# EAGLE design Steering Controller (EAGLE 8.4.1)
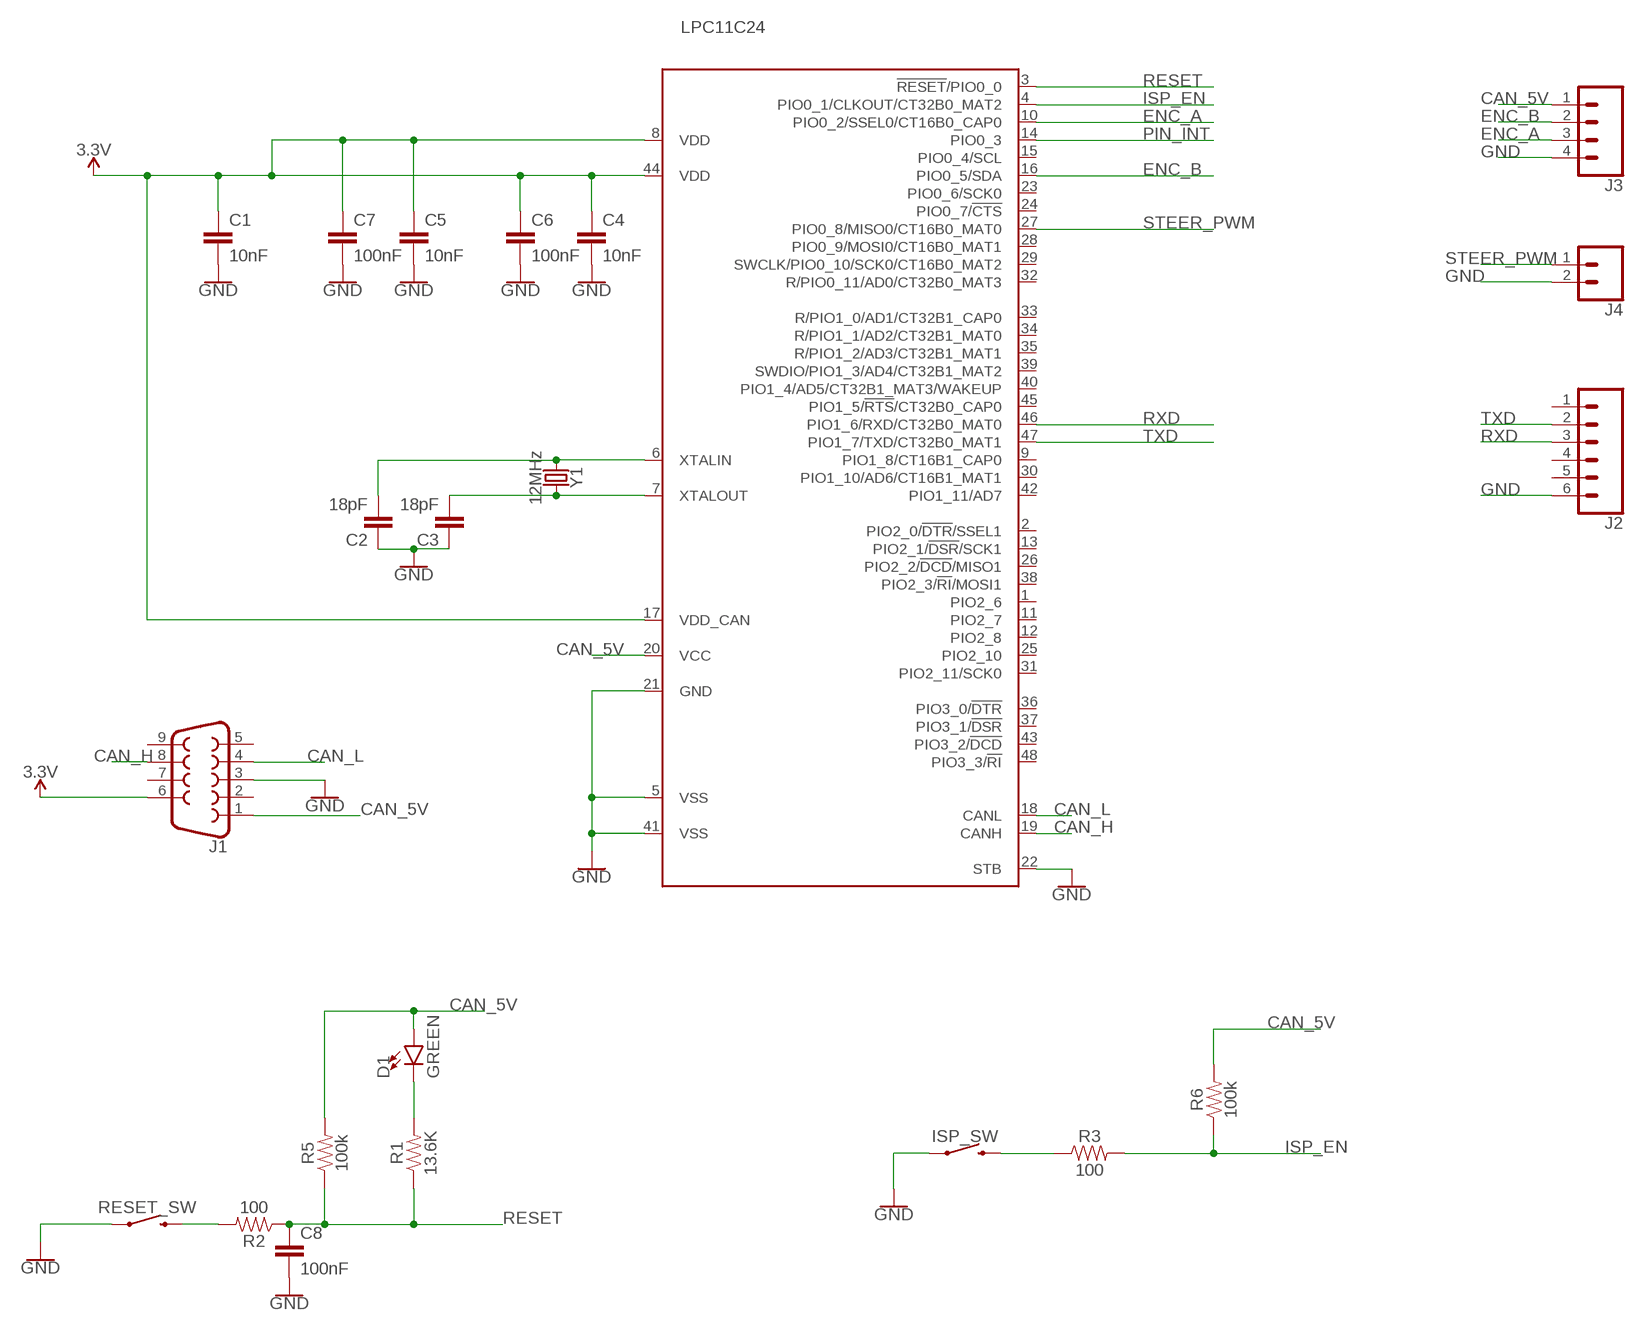
[diagram p0: schematic, sheet 1]

## Parts
C1  10nF  22PF-PTH-2.54MM-200V-5%  [CAP-PTH-2.54]
C2  18pF  22PF-PTH-2.54MM-200V-5%  [CAP-PTH-2.54]
C3  18pF  22PF-PTH-2.54MM-200V-5%  [CAP-PTH-2.54]
C4  10nF  22PF-PTH-2.54MM-200V-5%  [CAP-PTH-2.54]
C5  10nF  22PF-PTH-2.54MM-200V-5%  [CAP-PTH-2.54]
C6  100nF  22PF-PTH-2.54MM-200V-5%  [CAP-PTH-2.54]
C7  100nF  22PF-PTH-2.54MM-200V-5%  [CAP-PTH-2.54]
C8  100nF  22PF-PTH-2.54MM-200V-5%  [CAP-PTH-2.54]
D1  GREEN  LED-GREEN1206  [LED-1206]
ISP_SW  MOMENTARY-SWITCH-SPST-PTH-6.0MM  [TACTILE_SWITCH_PTH_6.0MM]
J1  DB9FEMALE  [DB9]
J2  CONN_06SILK_FEMALE_PTH  [1X06]
J3  CONN_04  [1X04]
J4  CONN_02  [1X02]
LPC11C24  LPC11C22/24-LQFP48  [LQFP48]
R1  13.6K  100KOHM-HORIZ-1/4W-1%  [AXIAL-0.3]
R2  100  100KOHM-HORIZ-1/4W-1%  [AXIAL-0.3]
R3  100  100OHM-HORIZ-1/4W-1%  [AXIAL-0.3]
R5  100k  100KOHM-HORIZ-1/4W-1%  [AXIAL-0.3]
R6  100k  100KOHM-HORIZ-1/4W-1%  [AXIAL-0.3]
RESET_SW  MOMENTARY-SWITCH-SPST-PTH-6.0MM  [TACTILE_SWITCH_PTH_6.0MM]
Y1  12MHz  CRYSTAL-16MHZPTH-HC49US  [HC49US]

## Nets
3.3V: C1.1 C4.1 C5.1 C6.1 C7.1 J1.6 LPC11C24.8(VDD) LPC11C24.17(VDD_CAN) LPC11C24.44(VDD)
CAN_5V: D1.A J1.1 J3.1 LPC11C24.20(VCC) R5.P$2 R6.P$2
CAN_H: J1.8 LPC11C24.19(CANH)
CAN_L: J1.4 LPC11C24.18(CANL)
ENC_A: J3.3 LPC11C24.10(PIO0_2/SSEL0/CT16B0_CAP0)
ENC_B: J3.2 LPC11C24.16(PIO0_5/SDA)
GND: C1.2 C2.1 C3.1 C4.2 C5.2 C6.2 C7.2 C8.2 ISP_SW.1 J1.3 J2.6 J3.4 J4.2 LPC11C24.5(VSS) LPC11C24.21(GND) LPC11C24.22(STB) LPC11C24.41(VSS) RESET_SW.1
ISP_EN: LPC11C24.4(PIO0_1/CLKOUT/CT32B0_MAT2) R3.P$2 R6.P$1
N$1: D1.C R1.P$2
N$2: R2.P$2 RESET_SW.3
N$4: ISP_SW.3 R3.P$1
PIN_INT: LPC11C24.14(PIO0_3)
RESET: C8.1 LPC11C24.3(!RESET!/PIO0_0) R1.P$1 R2.P$1 R5.P$1
RXD: J2.3 LPC11C24.46(PIO1_6/RXD/CT32B0_MAT0)
STEER_PWM: J4.1 LPC11C24.27(PIO0_8/MISO0/CT16B0_MAT0)
TXD: J2.2 LPC11C24.47(PIO1_7/TXD/CT32B0_MAT1)
XTALIN: C2.2 LPC11C24.6(XTALIN) Y1.1
XTALOUT: C3.2 LPC11C24.7(XTALOUT) Y1.2
Unconnected: J1.2 J1.5 J1.7 J1.9 J2.1 J2.4 J2.5 LPC11C24.1(PIO2_6) LPC11C24.2(PIO2_0/!DTR!/SSEL1) LPC11C24.9(PIO1_8/CT16B1_CAP0) LPC11C24.11(PIO2_7) LPC11C24.12(PIO2_8) LPC11C24.13(PIO2_1/!DSR!/SCK1) LPC11C24.15(PIO0_4/SCL) LPC11C24.23(PIO0_6/SCK0) LPC11C24.24(PIO0_7/!CTS!) LPC11C24.25(PIO2_10) LPC11C24.26(PIO2_2/!DCD!/MISO1) LPC11C24.28(PIO0_9/MOSI0/CT16B0_MAT1) LPC11C24.29(SWCLK/PIO0_10/SCK0/CT16B0_MAT2) LPC11C24.30(PIO1_10/AD6/CT16B1_MAT1) LPC11C24.31(PIO2_11/SCK0) LPC11C24.32(R/PIO0_11/AD0/CT32B0_MAT3) LPC11C24.33(R/PIO1_0/AD1/CT32B1_CAP0) LPC11C24.34(R/PIO1_1/AD2/CT32B1_MAT0) LPC11C24.35(R/PIO1_2/AD3/CT32B1_MAT1) LPC11C24.36(PIO3_0/!DTR!) LPC11C24.37(PIO3_1/!DSR!) LPC11C24.38(PIO2_3/!RI!/MOSI1) LPC11C24.39(SWDIO/PIO1_3/AD4/CT32B1_MAT2) LPC11C24.40(PIO1_4/AD5/CT32B1_MAT3/WAKEUP) LPC11C24.42(PIO1_11/AD7) LPC11C24.43(PIO3_2/!DCD!) LPC11C24.45(PIO1_5/!RTS!/CT32B0_CAP0) LPC11C24.48(PIO3_3/!RI!)

## Library data of the parts
C1-C8 = SparkFun-Capacitors:22PF: 22pF ceramic capacitors A capacitor is a passive two-terminal electrical component used to store electrical energy temporarily in an electric field.; PROD_ID: CAP-09128; VALUE: 22pF
D1 = SparkFun-LED:LED-GREEN: Green SMD LED Used in manufacturing of various products at SparkFun Packages: 0603 - SMD 0603 package [Product Link] <http://www.futureelectronics.com/en/technologies/semiconductors/optoelectronics/leds/Pages/9894312-LTST-C190GKT.aspx?CrossPart=HSMG-C190&IM=0> LilyPad 1206 - SMD1206 LilyPad package [Product Link] <http://www.futureelectronics.com/en/Technologies/Product.aspx?ProductID=IN150NGHARVATEKCORPORATION2049943&IM=0> 1206 - SMD1206 package [Product Link] <http://www.futureelectronics.com/en/technologies/semiconductors/optoelectronics/leds/Pages/8315665-LTST-C150KGKT.aspx?IM=0> 1206 Bottom Mount -SMD 1206 Bottom Mount [Product Link] <http://www.digikey.com/product-detail/en/lite-on-inc/LTST-C230KGKT/160-1456-1-ND/386854> SparkFun Products: Pro Mini 328 -5V <https://www.sparkfun.com/products/821> RedBoard <https://www.sparkfun.com/products/12757> MP3 Trigger <https://www.sparkfun.com/products/13720> Makey Makey <https://www.sparkfun.com/products/11076>; PROD_ID: DIO-00862
ISP_SW RESET_SW = SparkFun-Switches:MOMENTARY-SWITCH-SPST: Momentary Switch (Pushbutton) - SPST Normally-open (NO) SPST momentary switches (buttons, pushbuttons). Variants PTH-12MM - 12mm square, through-hole Momentary Pushbutton Switch - 12mm Square <https://www.sparkfun.com/products/9190> (COM-09190) PTH-6.0MM, PTH-6.0MM-KIT - 6.0mm square, through-hole Mini Pushbutton Switch <https://www.sparkfun.com/products/97> (COM-00097) KIT package intended for soldering kit's - only one side of pads' copper is exposed. PTH-RIGHT-ANGLE-KIT - Right-angle, through-hole Right Angle Tactile Button <https://www.sparkfun.com/products/10791> - Used on SparkFun BigTime Watch Kit <https://www.sparkfun.com/products/11734> SMD-12MM - 12mm square, surface-mount Tactile Button - SMD (12mm) <https://www.sparkfun.com/products/12993> (COM-12993) Used on SparkFun PicoBoard <https://www.sparkfun.com/products/11888> SMD-4.5MM - 4.5mm Square Trackball Switch Used on SparkFun Blackberry Trackballer Breakout <https://www.sparkfun.com/products/13169> SMD-4.6MMX2.8MM - 4.60mm x 2.80mm, surface mount Used on SparkFun SAMD21 Mini Breakout <https://www.sparkfun.com/products/13664> SMD-5.2MM, SMD-5.2-REDUNDANT - 5.2mm square, surface-mount Mini Pushbutton Switch - SMD <https://www.sparkfun.com/products/8720> (COM-08720) Used on Arduino Pro Mini <https://www.sparkfun.com/products/11114> REDUNDANT package connects both switch circuits together SMD-6.0X3.5MM - 6.0 x 3.5mm, surface mount Momentary Reset Switch SMD <https://www.sparkfun.com/products/8229> (COM-08229) SMD-6.2MM-TALL - 6.2mm square, surface mount Tactile Button - SMD (6mm) <https://www.sparkfun.com/products/12992> Used on SparkFun Digital Sandbox <https://www.sparkfun.com/products/12651> SMD-RIGHT-ANGLE - Right-angle, surface mount Used on SparkFun Block for Intel® Edison - Arduino <https://www.sparkfun.com/products/13036>; PROD_ID: SWCH-08441; SF_SKU: COM-00097
J1 = SparkFun-Connectors:DB9: DB9 Connector Standard DB9 (D-Sub 9) serial connector. Can be used for CAN bus as well as RS485 and RS232. Footprint production proven. Here is the female version connector we sell at SparkFun: 9 Pin Female Serial Connector - PCB Mount <https://www.sparkfun.com/products/429> (PRT-00429) This connector has been used on the following SparkFun products: SparkFun RS232 Shifter - SMD <https://www.sparkfun.com/products/449> (PRT-00449) SparkFun RS232 Shifter SMD (No DB9) <https://www.sparkfun.com/products/8780> (PRT-08780); PROD_ID: CONN-08194
J2 = SparkFun-Connectors:CONN_06: Multi connection point. Often used as Generic Header-pin footprint for 0.1 inch spaced/style header connections On any of the 0.1 inch spaced packages, you can populate with these: Break Away Headers - Straight <https://www.sparkfun.com/products/116> (PRT-00116) Break Away Male Headers - Right Angle <https://www.sparkfun.com/products/553> (PRT-00553) Female Headers <https://www.sparkfun.com/products/115> (PRT-00115) Break Away Headers - Machine Pin <https://www.sparkfun.com/products/117> (PRT-00117) Break Away Female Headers - Swiss Machine Pin <https://www.sparkfun.com/products/743> (PRT-00743) Arduino Stackable Header - 6 Pin <https://www.sparkfun.com/products/9280> (PRT-09280) For SCREWTERMINALS and SPRING TERMINALS visit here: Screw Terimnals on SparkFun.com <https://www.sparkfun.com/search/results?term=Screw+Terminals> (5mm/3.5mm/2.54mm spacing) This device is also useful as a general connection point to wire up your design to another part of your project. Our various solder wires solder well into these plated through hole pads. Hook-Up Wire - Assortment (Stranded, 22 AWG) <https://www.sparkfun.com/products/11375> (PRT-11375) Hook-Up Wire - Assortment (Solid Core, 22 AWG) <https://www.sparkfun.com/products/11367> (PRT-11367) View the entire wire category on our website here <https://www.sparkfun.com/categories/141>; PROD_ID: CONN-08437
J3 = SparkFun-Connectors:CONN_04: Multi connection point. Often used as Generic Header-pin footprint for 0.1 inch spaced/style header connections On any of the 0.1 inch spaced packages, you can populate with these: Break Away Headers - Straight <https://www.sparkfun.com/products/116> (PRT-00116) Break Away Male Headers - Right Angle <https://www.sparkfun.com/products/553> (PRT-00553) Female Headers <https://www.sparkfun.com/products/115> (PRT-00115) Break Away Headers - Machine Pin <https://www.sparkfun.com/products/117> (PRT-00117) Break Away Female Headers - Swiss Machine Pin <https://www.sparkfun.com/products/743> (PRT-00743) For SCREWTERMINALS and SPRING TERMINALS visit here: Screw Terimnals on SparkFun.com <https://www.sparkfun.com/search/results?term=Screw+Terminals> (5mm/3.5mm/2.54mm spacing) This device is also useful as a general connection point to wire up your design to another part of your project. Our various solder wires solder well into these plated through hole pads. Hook-Up Wire - Assortment (Stranded, 22 AWG) <https://www.sparkfun.com/products/11375> (PRT-11375) Hook-Up Wire - Assortment (Solid Core, 22 AWG) <https://www.sparkfun.com/products/11367> (PRT-11367) View the entire wire category on our website here <https://www.sparkfun.com/categories/141> Special notes: Molex polarized connector foot print use with SKU : PRT-08231 with associated crimp pins and housings. 1MM SMD Version SKU: PRT-10208; PROD_ID: CONN-09696
J4 = SparkFun-Connectors:CONN_02: Multi connection point. Often used as Generic Header-pin footprint for 0.1 inch spaced/style header connections On any of the 0.1 inch spaced packages, you can populate with these: Break Away Headers - Straight <https://www.sparkfun.com/products/116> (PRT-00116) Break Away Male Headers - Right Angle <https://www.sparkfun.com/products/553> (PRT-00553) Female Headers <https://www.sparkfun.com/products/115> (PRT-00115) Break Away Headers - Machine Pin <https://www.sparkfun.com/products/117> (PRT-00117) Break Away Female Headers - Swiss Machine Pin <https://www.sparkfun.com/products/743> (PRT-00743) For SCREWTERMINALS and SPRING TERMINALS visit here: Screw Terimnals on SparkFun.com <https://www.sparkfun.com/search/results?term=Screw+Terminals> (5mm/3.5mm/2.54mm spacing) This device is also useful as a general connection point to wire up your design to another part of your project. Our various solder wires solder well into these plated through hole pads. Hook-Up Wire - Assortment (Stranded, 22 AWG) <https://www.sparkfun.com/products/11375> (PRT-11375) Hook-Up Wire - Assortment (Solid Core, 22 AWG) <https://www.sparkfun.com/products/11367> (PRT-11367) View the entire wire category on our website here <https://www.sparkfun.com/categories/141> Special notes: Molex polarized connector foot print use with: PRT-08233 with associated crimp pins and housings. 2.54_SCREWTERM for use with PRT-10571. 3.5mm Screw Terminal footprints for PRT-08084 5mm Screw Terminal footprints for use with PRT-08432
LPC11C24 = lpc1100v1.1:LPC11C22/24-LQFP48: NXP Semiconductors LPC11Cxx microcontrollers <http://ics.nxp.com/products/lpc1000/lpc11xx/lpc11cxx/> ARM 32-bit Cortex-M0 Microcontroller with MPU CPU clock up to 50MHz 32KByte on-chip Flash ROM with In-System Programming (ISP) and In-Application Programming (IAP) via On-Chip Bootloader 8KByte SRAM Nested Vectored Interrupt Controller 2 SPI controllers CAN controller On-chip, high-speed CAN transciever UART with full Modem Interface and RS485 Support Fast Mode I2C-Bus 4 Timers with 4 capture channels and 12 output channels Watchdog (WDT) Sytem tick timer 10-bit ADC with 8 channels Power Management Unit (PMU) Brownout detection 12MHz internal RC oscillator Serial Wire Debug/Trace port
R1 R2 = SparkFun-Resistors:100KOHM: 100kΩ resistor A resistor is a passive two-terminal electrical component that implements electrical resistance as a circuit element. Resistors act to reduce current flow, and, at the same time, act to lower voltage levels within circuits. - Wikipedia; PROD_ID: RES-12184; VALUE: 100k
R3 = SparkFun-Resistors:100OHM: 100Ω resistor A resistor is a passive two-terminal electrical component that implements electrical resistance as a circuit element. Resistors act to reduce current flow, and, at the same time, act to lower voltage levels within circuits. - Wikipedia; PROD_ID: RES-12181
R5 R6 = SparkFun-Resistors:100KOHM: 100kΩ resistor A resistor is a passive two-terminal electrical component that implements electrical resistance as a circuit element. Resistors act to reduce current flow, and, at the same time, act to lower voltage levels within circuits. - Wikipedia; PROD_ID: RES-12184
Y1 = SparkFun-Clocks:CRYSTAL-16MHZ: 16MHz Crystal Digikey Example <http://www.digikey.com/product-search/en?keywords=535-9122-1-ND> Frequency: 16MHz Frequency Stability: ±50ppm Frequency Tolerance: ±20ppm Load Capacitance: 18pF SparkFun Products: Pro Micro -5V/16MHz <https://www.sparkfun.com/products/12640> SparkFun Serial Enabled LCD Kit <https://www.sparkfun.com/products/10097>; PROD_ID: XTAL-08181; SF_ID: COM-00536; VALUE: 16MHz

## Board
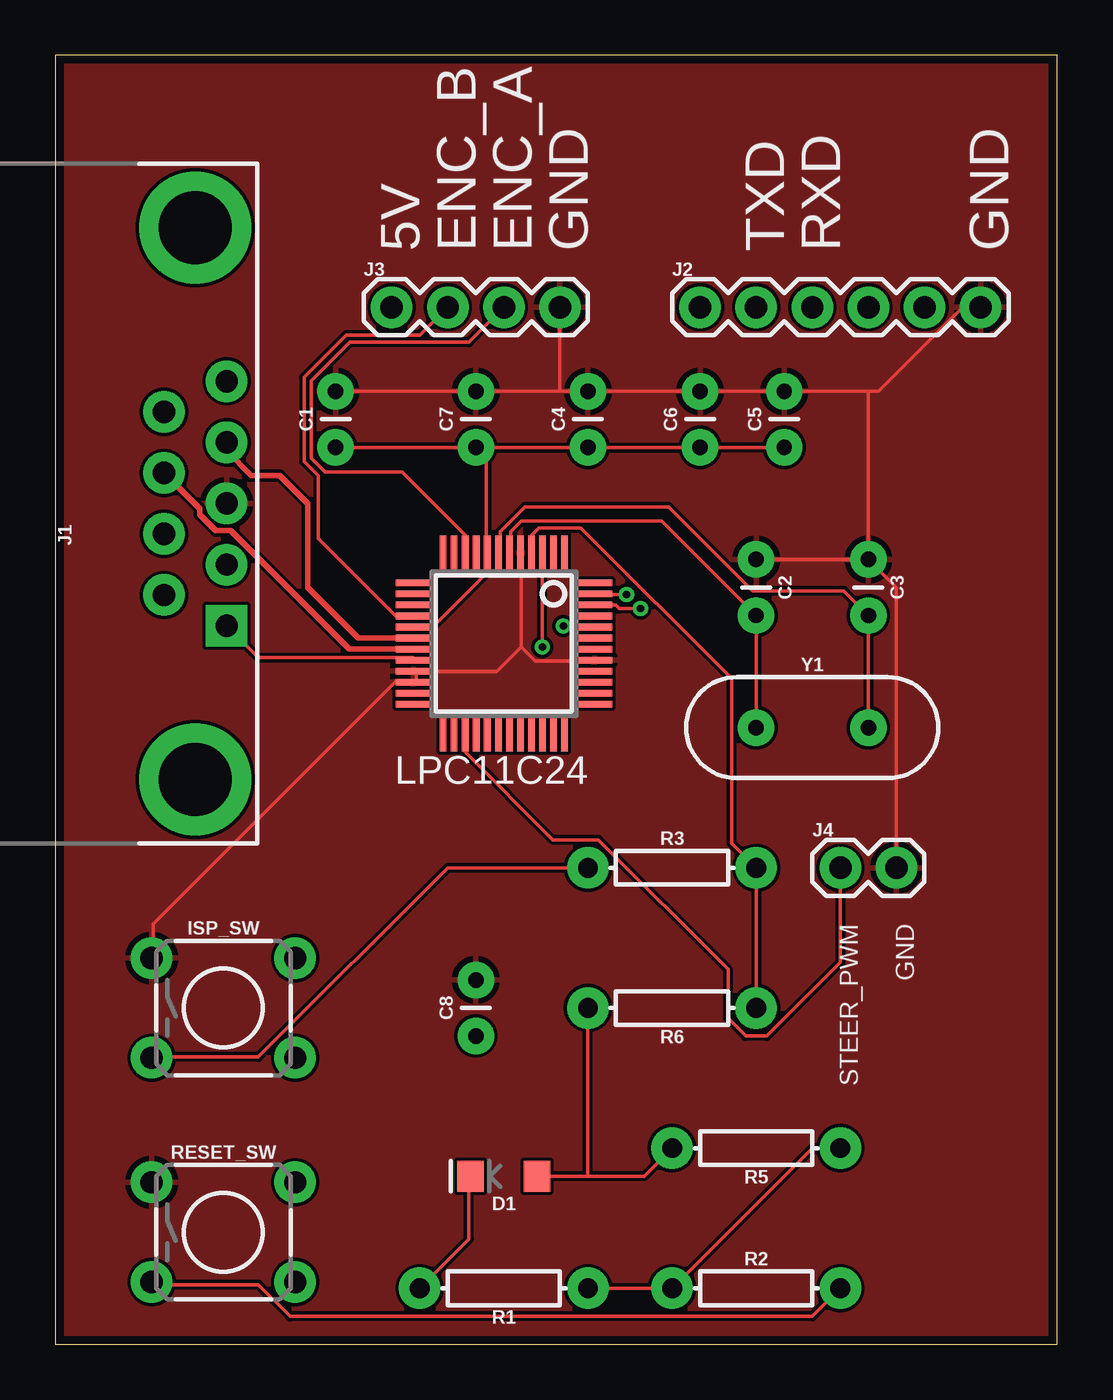
[diagram p1: board, top side]
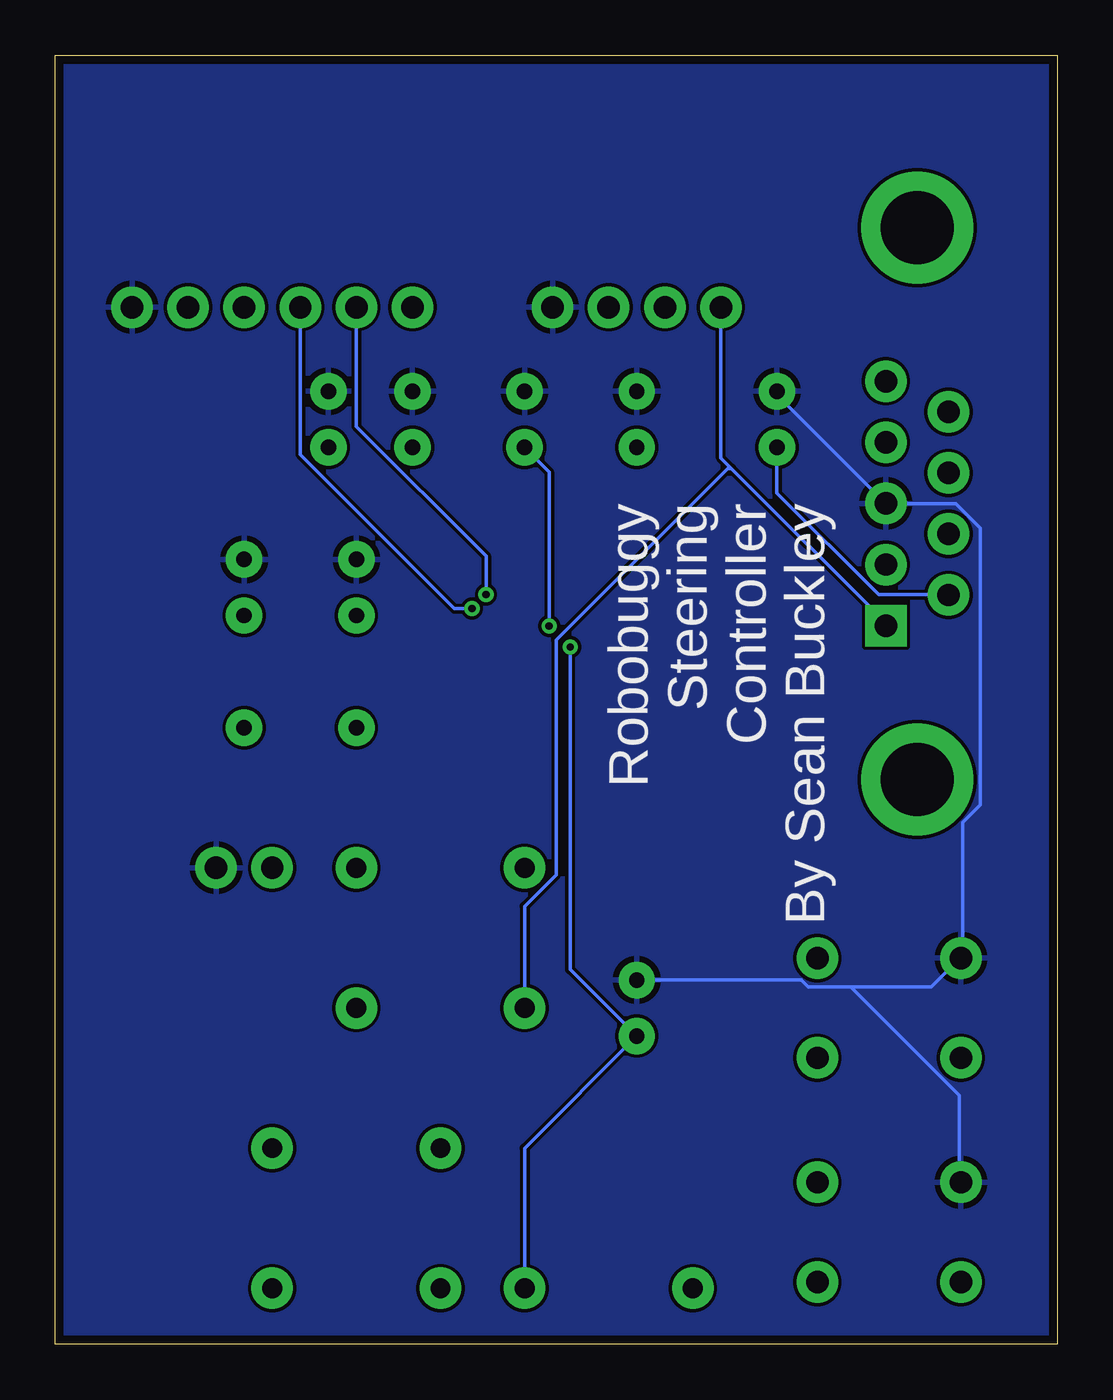
[diagram p2: board, bottom side, seen from below]

Size 45.39 x 58.41 mm. Coordinates in mm from the lower left corner, seen from the top.
Outline: 0,0 45.39,0 45.39,58.41 0,58.41 0,0
Copper layers (1*16): Top 0.0356mm / dielectric 1.5011mm / Bottom 0.0356mm
Design rules "oshpark-2layer": minimum track width 6mil, minimum drill 13mil, track to track 6mil, track to pad 6mil, pad to pad 6mil, via to via 6mil, smd to smd 6mil, copper to edge 15mil, drill to drill 6mil, minimum pad ring 7mil, minimum via ring 7mil, stop-mask expansion 2.5mil, vias tented up to drill 0mil, thermal gap 10mil

### Footprints (pad centres in the part's own frame; a part is rotated, then mirrored left to right if it is on the bottom)
CAP-PTH-2.54 = drill 0.7 pad 1.651: 1 -1.27,0; 2 1.27,0
LED-1206 = smd 1.2 x 1.4: A -1.5,0; C 1.5,0
TACTILE_SWITCH_PTH_6.0MM = drill 1.016 pad 1.88: 1 -3.251,2.261; 2 3.251,2.261; 3 -3.251,-2.261; 4 3.251,-2.261
DB9 = drill 1.016 pad 1.88 square: 1 -5.54,-1.42 | drill 1.016 pad 1.88: 2 -2.77,-1.42; 3 0,-1.42; 4 2.77,-1.42; 5 5.54,-1.42; 6 -4.15,1.42; 7 -1.38,1.42; 8 1.38,1.42; 9 4.15,1.42 | drill 3.302 pad 5.08: G1 -12.5,0; G2 12.5,0
1X06 = drill 1.016 pad 1.88: 1 0,0; 2 2.54,0; 3 5.08,0; 4 7.62,0; 5 10.16,0; 6 12.7,0
1X04 = drill 1.016 pad 1.88: 1 0,0; 2 2.54,0; 3 5.08,0; 4 7.62,0
1X02 = drill 1.016 pad 1.88: 1 0,0; 2 2.54,0
LQFP48 = smd 0.3 x 1.6: 1 -2.75,-4.1; 2 -2.25,-4.1; 3 -1.75,-4.1; 4 -1.25,-4.1; 5 -0.75,-4.1; 6 -0.25,-4.1; 7 0.25,-4.1; 8 0.75,-4.1; 9 1.25,-4.1; 10 1.75,-4.1; 11 2.25,-4.1; 12 2.75,-4.1; 25 2.75,4.1; 26 2.25,4.1; 27 1.75,4.1; 28 1.25,4.1; 29 0.75,4.1; 30 0.25,4.1; 31 -0.25,4.1; 32 -0.75,4.1; 33 -1.25,4.1; 34 -1.75,4.1; 35 -2.25,4.1; 36 -2.75,4.1 | smd 1.6 x 0.3: 13 4.1,-2.75; 14 4.1,-2.25; 15 4.1,-1.75; 16 4.1,-1.25; 17 4.1,-0.75; 18 4.1,-0.25; 19 4.1,0.25; 20 4.1,0.75; 21 4.1,1.25; 22 4.1,1.75; 23 4.1,2.25; 24 4.1,2.75; 37 -4.1,2.75; 38 -4.1,2.25; 39 -4.1,1.75; 40 -4.1,1.25; 41 -4.1,0.75; 42 -4.1,0.25; 43 -4.1,-0.25; 44 -4.1,-0.75; 45 -4.1,-1.25; 46 -4.1,-1.75; 47 -4.1,-2.25; 48 -4.1,-2.75
AXIAL-0.3 = drill 0.9 pad 1.88: P$1 -3.81,0; P$2 3.81,0
HC49US = drill 0.7 pad 1.651: 1 -2.54,0; 2 2.54,0

### Placement (x,y rotation side)
C1  12.7,41.91 90 top
C2  31.75,34.29 270 top
C3  36.83,34.29 270 top
C4  24.13,41.91 90 top
C5  33.02,41.91 90 top
C6  29.21,41.91 90 top
C7  19.05,41.91 90 top
C8  19.05,15.24 90 top
D1  20.32,7.62 180 top
ISP_SW  7.62,15.24 0 top
J1  6.35,38.1 90 top
J2  29.21,46.99 0 top
J3  15.24,46.99 0 top
J4  35.56,21.59 0 top
LPC11C24  20.32,31.75 180 top
R1  20.32,2.54 180 top
R2  31.75,2.54 0 top
R3  27.94,21.59 0 top
R5  31.75,8.89 180 top
R6  27.94,15.24 180 top
RESET_SW  7.62,5.08 0 top
Y1  34.29,27.94 0 top

### Tracks (layer width: path | path; a pad name or v marks a point on that pad's centre or on a via)
3.3V  (via drill 0.33)
  Top 0.152: C5.1 C6.1 C4.1 C7.1 | v23.02,32.54 24.29,32.54 LPC11C24.44 | LPC11C24.17 16.35,32.54 17.14,32.54 19.53,34.92 19.53,35.72 LPC11C24.8 19.53,35.88 19.53,40.16 C7.1 | C7.1 C1.1
  Bottom 0.152: v23.02,32.54 23.02,39.53 C4.1 | C1.1 12.7,38.58 8.1,33.97 5.08,33.97 J1.6
CAN_5V
  Top 0.152: 24.13,7.62 26.67,7.62 R5.P$2 | 24.13,7.62 D1.A | 24.13,7.62 R6.P$2 | LPC11C24.20 16.19,31.11 9.21,31.11 7.78,32.54 J1.1
  Bottom 0.152: J3.1 15.24,40.16 14.76,39.69 | 14.76,39.69 7.78,32.7 J1.1 | R6.P$2 24.13,19.84 22.7,21.27 22.7,31.91 14.92,39.69 14.76,39.69
CAN_H
  Top 0.254: J1.8 6.55,37.86 6.55,37.59 7.26,36.88 7.94,36.88 13.32,31.5 LPC11C24.19
CAN_L
  Top 0.254: LPC11C24.18 13.72,32 11.43,34.29 11.43,38.1 10.16,39.37 8.89,39.37 7.77,40.49 J1.4
ENC_A
  Top 0.152: J3.3 18.73,45.4 13.34,45.4 11.59,43.66 11.59,40.16 12.22,39.53 15.72,39.53 18.57,36.67 18.57,35.88 LPC11C24.10
ENC_B
  Top 0.152: J3.2 16.51,45.72 13.18,45.72 11.27,43.81 11.27,40 11.91,39.37 11.91,36.51 15.4,33.02 16.19,33.02 LPC11C24.16
GND
  Top 0.152: 16.35,30.48 16.35,30 LPC11C24.22 16.19,30 15.4,30 4.45,19.05 4.45,17.62 ISP_SW.1 | 21.11,31.59 21.11,35.72 LPC11C24.5 | 21.11,31.59 21.75,30.96 24.29,30.96 LPC11C24.41 | 16.35,30.48 20,30.48 21.11,31.59 | 16.35,30.48 LPC11C24.21 | C3.1 C2.1 | J4.2 38.1,34.29 C3.1 | J2.6 41.12,46.99 37.31,43.18 36.83,43.18 | 36.83,43.18 C5.2 C6.2 C4.2 22.86,43.18 | C1.2 C7.2 22.86,43.18 | 22.86,43.18 J3.4 | 36.83,43.18 C3.1
  Bottom 0.152: C8.2 11.59,16.51 11.27,16.19 9.37,16.19 | 9.37,16.19 5.71,16.19 4.45,17.46 ISP_SW.1 4.29,17.62 4.29,23.65 3.49,24.45 3.49,36.99 4.6,38.1 J1.3 12.7,43.02 C1.2 | 9.37,16.19 4.45,11.27 4.45,7.46 RESET_SW.1
  pour Top: 0,58.42 44.45,58.42 45.72,58.42 45.72,0 0,0
  pour Bottom: 0,58.42 45.72,58.42 45.72,0 0,0
ISP_EN
  Top 0.152: LPC11C24.4 21.59,35.88 21.59,36.67 21.91,36.99 23.81,36.99 30.64,30.16 30.64,22.7 R3.P$2 R6.P$1
N$1
  Top 0.152: R1.P$2 18.73,4.76 18.73,7.62 D1.C
N$2
  Top 0.152: R2.P$2 34.29,1.27 10.64,1.27 9.21,2.7 4.45,2.7 RESET_SW.3
N$4
  Top 0.152: R3.P$1 17.78,21.59 9.21,13.02 4.45,13.02 ISP_SW.3
RESET  (via drill 0.33)
  Top 0.152: R1.P$1 R2.P$1 34.29,8.89 R5.P$1 | v22.07,31.59 22.07,35.72 LPC11C24.3
  Bottom 0.152: v22.07,31.59 22.07,16.99 C8.1 24.13,8.89 R1.P$1
RXD  (via drill 0.33)
  Top 0.152: v26.51,33.34 25.56,33.34 25.4,33.5 24.45,33.5 LPC11C24.46
  Bottom 0.152: v26.51,33.34 27.3,33.34 34.29,40.32 J2.3
STEER_PWM
  Top 0.152: J4.1 35.56,17.3 32.23,13.97 31.27,13.97 30.48,14.76 30.48,16.99 24.61,22.86 22.54,22.86 18.57,26.83 18.57,27.62 LPC11C24.27
TXD  (via drill 0.33)
  Top 0.152: v25.88,33.97 24.45,33.97 LPC11C24.47
  Bottom 0.152: v25.88,33.97 25.88,35.72 31.75,41.59 J2.2
XTALIN
  Top 0.152: LPC11C24.6 20.64,35.88 20.64,36.83 21.11,37.31 27.46,37.31 C2.2 Y1.1
XTALOUT
  Top 0.152: LPC11C24.7 20.16,35.88 20.16,36.83 21.27,37.94 27.78,37.94 31.59,34.13 35.72,34.13 C3.2 Y1.2

### Text on the board
tNames: 5V | ENC_B | ENC_A | GND | TXD | RXD | GND | STEER_PWM | GND
bNames: Robobuggy / Steering / Controller / By Sean Buckley